# Altium schematic sheet ref_mcp1502_2p5.SchDoc
size A
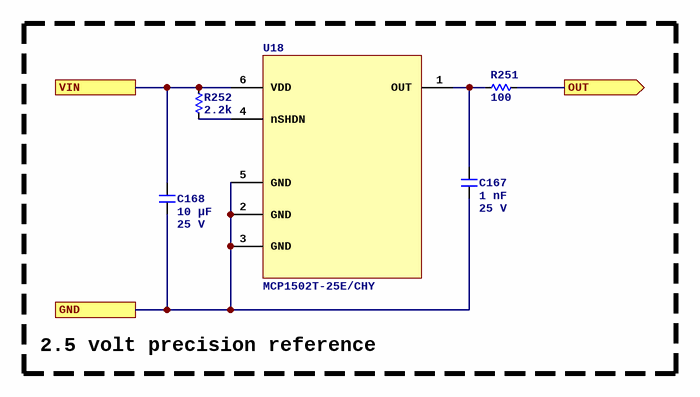
[diagram p0: ref_mcp1502_2p5.SchDoc]

## Parts
C167  Capacitance: 1 nF  Voltage Rating: 25 V  [C0402]  (hidden comment: C1005C0G1E102JT000F)
C168  Capacitance: 10 µF  Voltage Rating: 25 V  [C0603]  (hidden comment: CL10A106MA8NRNC)
R251  value 100  [R0402]  (hidden comment: RC0402FR-07100RL)
R252  value 2.2k  [R0402]  (hidden comment: 0402WGF2201TCE)
U18  MCP1502T-25E/CHY  [6SOT23]

## Blocks framed on the sheet
2.5 volt precision reference: C167 C168 R251 R252 U18

## Ports
GND, OUT (out), VIN

## Nets
GND: C167.2 C168.2 U18.2(GND) U18.3(GND) U18.5(GND) ; port GND
OUT: R251.2 ; port OUT
VIN: C168.1 R252.1 U18.6(VDD) ; port VIN
NetC167_1: C167.1 R251.1 U18.1(OUT)
NetR252_2: R252.2 U18.4(nSHDN)

## Library data of the parts
C167 = C1005C0G1E102JT000F: Manufacturer: TDK; Dielectric: C0G; ComponentLink1URL: https://wmsc.lcsc.com/wmsc/upload/file/pdf/v2/lcsc/2304140030_TDK-C1005C0G1E102JT000F_C343059.pdf; ComponentLink1Description: Datasheet; Manufacturer Part Number: C1005C0G1E102JT000F; Package: 0402; Supplier 2: LCSC; Supplier Part Number 2: C343059
C168 = CL10A106MA8NRNC: Manufacturer: Samsung Electro-Mechanics; Dielectric: X5R; ComponentLink1URL: https://wmsc.lcsc.com/wmsc/upload/file/pdf/v2/lcsc/2304140030_Samsung-Electro-Mechanics-CL10A106MA8NRNC_C96446.pdf; ComponentLink1Description: Datasheet; Manufacturer Part Number: CL10A106MA8NRNC; Package: 0603; Supplier 2: LCSC; Supplier Part Number 2: C96446
R251 = RC0402FR-07100RL: Manufacturer: YAGEO; Tolerance: 1%; Temperature Coefficient: ±100ppm/?; Power Rating (mW): 62.5; ComponentLink1Description: Datasheet; ComponentLink1URL: https://wmsc.lcsc.com/wmsc/upload/file/pdf/v2/lcsc/2304140030_YAGEO-RC0402FR-07100RL_C106232.pdf; Manufacturer Part Number: RC0402FR-07100RL; Package: 0402; Supplier 2: LCSC; Supplier Part Number 2: C106232
R252 = 0402WGF2201TCE: Manufacturer: UNI-ROYAL(Uniroyal Elec); Tolerance: 1%; Temperature Coefficient: ±100ppm/?; Power Rating (mW): 62.5; ComponentLink1Description: Datasheet; ComponentLink1URL: https://wmsc.lcsc.com/wmsc/upload/file/pdf/v2/lcsc/2206010045_UNI-ROYAL-Uniroyal-Elec-0402WGF2201TCE_C25879.pdf; Manufacturer Part Number: 0402WGF2201TCE; Package: 0402; Supplier 2: LCSC; Supplier Part Number 2: C25879
U18 = MCP1502T-25E/CHY: IC 7 PPM 0.1% VOLTAGE REFERENCE Series Voltage Reference IC Fixed 2.5V V ±0.1% 20 mA SOT-23-6; Manufacturer: Microchip; Supplier 1: DigiKey; Supplier Part Number 1: 150-MCP1502T-25E/CHYCT-ND; Manufacturer Part Number: MCP1502T-25E/CHY; Supplier 2: LCSC; Supplier Part Number 2: C3680051; ComponentLink1Description: Datasheet; ComponentLink1URL: https://ww1.microchip.com/downloads/aemDocuments/documents/MSLD/ProductDocuments/DataSheets/MCP1502-Data-Sheet-20006593B.pdf; Supplier 3: Mouser; Supplier Part Number 3: 579-MCP1502T-25E/CHY